# EAGLE schematic Internalcomputer (EAGLE 9.5.1)
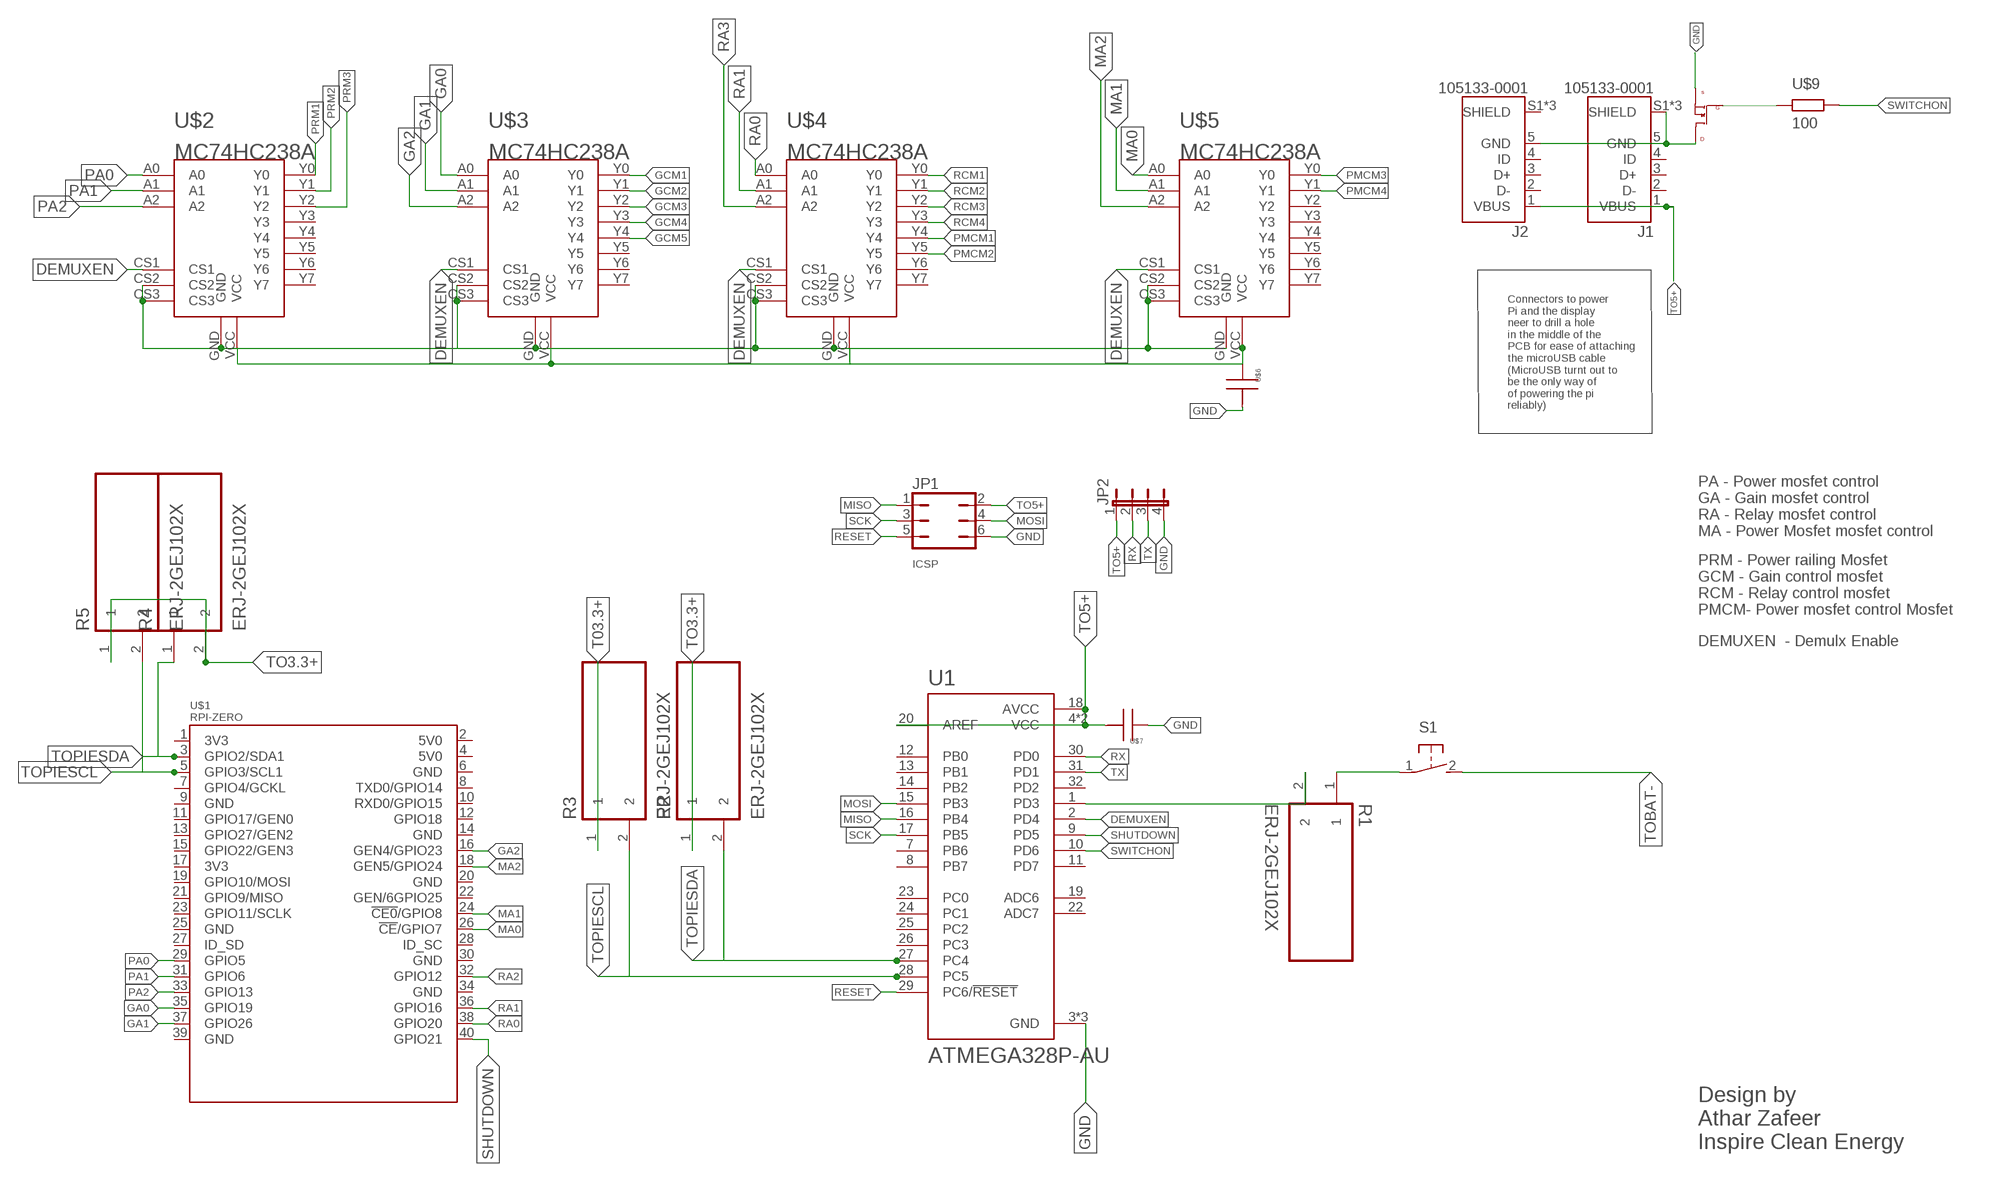
[diagram p0: schematic, sheet 1]

## Parts
J1  105133-0001  [MOLEX_105133-0001]
J2  105133-0001  [MOLEX_105133-0001]
JP1  JP3Q  [JP3Q]
JP2  JP4E  [JP4]
R1  ERJ-2GEJ102X  [RESC1005X40N]
R2  ERJ-2GEJ102X  [RESC1005X40N]
R3  ERJ-2GEJ102X  [RESC1005X40N]
R4  ERJ-2GEJ102X  [RESC1005X40N]
R5  ERJ-2GEJ102X  [RESC1005X40N]
S1  31-XX  [B3F-31XX]
U1  ATMEGA328P-AU  [QFP80P900X900X120-32N]
U$1  RPI-ZERO  [RASPBERRYPI_BASTELSTUBE_V13_RASPI_BOARD_B+_FULL]
U$2  MC74HC238A  [TSSOP−16]
U$3  MC74HC238A  [TSSOP−16]
U$4  MC74HC238A  [TSSOP−16]
U$5  MC74HC238A  [TSSOP−16]
U$6  CAPACTORFORTRANSFORMER  [C1210C156K8PACTU]
U$7  CAPACTORFORTRANSFORMER  [C1210C156K8PACTU]
U$8  SI2302A  [SOT-23]
U$9  RX0402_100  [RC0402_100]

## Nets
DEMUXEN: U1.2(PD4) U$2.CS1 U$3.CS1 U$4.CS1 U$5.CS1
GA0: U$1.35(GPIO19) U$3.A0
GA1: U$1.37(GPIO26) U$3.A1
GA2: U$1.16(GEN4/GPIO23) U$3.A2
GCM1: U$3.Y0
GCM2: U$3.Y1
GCM3: U$3.Y2
GCM4: U$3.Y3
GCM5: U$3.Y4
GND: J1.5(GND) J1.S1(SHIELD) J1.S2(SHIELD) J1.S3(SHIELD) J2.5(GND) JP1.6 JP2.4 U1.3(GND) U1.5(GND) U1.21(GND) U$6.P$2 U$7.P$1 U$8.D U$8.S
MA0: U$1.26(!CE!/GPIO7) U$5.A0
MA1: U$1.24(!CE0!/GPIO8) U$5.A1
MA2: U$1.18(GEN5/GPIO24) U$5.A2
MISO: JP1.1 U1.16(PB4)
MOSI: JP1.4 U1.15(PB3)
N$1: R1.1 S1.1(P)
N$2: R1.2 U1.1(PD3)
N$3: U$2.CS2 U$2.CS3 U$2.GND U$3.CS2 U$3.CS3 U$3.GND U$4.CS2 U$4.CS3 U$4.GND U$5.CS2 U$5.CS3 U$5.GND
N$5: U$8.G U$9.P$1
N$9: U$2.VCC U$3.VCC U$4.VCC U$5.VCC U$6.P$1
PA0: U$1.29(GPIO5) U$2.A0
PA1: U$1.31(GPIO6) U$2.A1
PA2: U$1.33(GPIO13) U$2.A2
PMCM1: U$4.Y4
PMCM2: U$4.Y5
PMCM3: U$5.Y0
PMCM4: U$5.Y1
PRM1: U$2.Y0
PRM2: U$2.Y1
PRM3: U$2.Y2
RA0: U$1.38(GPIO20) U$4.A0
RA1: U$1.36(GPIO16) U$4.A1
RA2: U$1.32(GPIO12)
RA3: U$4.A2
RCM1: U$4.Y0
RCM2: U$4.Y1
RCM3: U$4.Y2
RCM4: U$4.Y3
RESET: JP1.5 U1.29(PC6/!RESET)
RX: JP2.2 U1.30(PD0)
SCK: JP1.3 U1.17(PB5)
SHUTDOWN: U1.9(PD5) U$1.40(GPIO21)
SWITCHON: U1.10(PD6) U$9.P$2
T03.3+: R3.1
TO3.3+: R2.1 R4.2 R5.1
TO5+: J1.1(VBUS) J2.1(VBUS) JP1.2 JP2.1 U1.4(VCC) U1.6(VCC) U1.18(AVCC) U1.20(AREF) U$7.P$2
TOBAT-: S1.2(S)
TOPIESCL: R3.2 R5.2 U1.28(PC5) U$1.5(GPIO3/SCL1)
TOPIESDA: R2.2 R4.1 U1.27(PC4) U$1.3(GPIO2/SDA1)
TX: JP2.3 U1.31(PD1)
Unconnected: J1.2(D-) J1.3(D+) J1.4(ID) J2.2(D-) J2.3(D+) J2.4(ID) J2.S1(SHIELD) J2.S2(SHIELD) J2.S3(SHIELD) U1.7(PB6) U1.8(PB7) U1.11(PD7) U1.12(PB0) U1.13(PB1) U1.14(PB2) U1.19(ADC6) U1.22(ADC7) U1.23(PC0) U1.24(PC1) U1.25(PC2) U1.26(PC3) U1.32(PD2) U$1.1(3V3) U$1.2(5V0) U$1.4(5V0) U$1.6(GND) U$1.7(GPIO4/GCKL) U$1.8(TXD0/GPIO14) U$1.9(GND) U$1.10(RXD0/GPIO15) U$1.11(GPIO17/GEN0) U$1.12(GPIO18) U$1.13(GPIO27/GEN2) U$1.14(GND) U$1.15(GPIO22/GEN3) U$1.17(3V3) U$1.19(GPIO10/MOSI) U$1.20(GND) U$1.21(GPIO9/MISO) U$1.22(GEN/6GPIO25) U$1.23(GPIO11/SCLK) U$1.25(GND) U$1.27(ID_SD) U$1.28(ID_SC) U$1.30(GND) U$1.34(GND) U$1.39(GND) U$2.Y3 U$2.Y4 U$2.Y5 U$2.Y6 U$2.Y7 U$3.Y5 U$3.Y6 U$3.Y7 U$4.Y6 U$4.Y7 U$5.Y2 U$5.Y3 U$5.Y4 U$5.Y5 U$5.Y6 U$5.Y7

## Notes on the sheet
- Connectors to power
  Pi and the display
  neer to drill a hole 
  in the middle of the
  PCB for ease of attaching
  the microUSB cable
  (MicroUSB turnt out to
  be the only way of 
  of powering the pi
  reliably)
- PA - Power mosfet control  
  GA - Gain mosfet control
  RA - Relay mosfet control
  MA - Power Mosfet mosfet control
- ICSP
- PRM - Power railing Mosfet
  GCM - Gain control mosfet
  RCM - Relay control mosfet
  PMCM- Power mosfet control Mosfet
- DEMUXEN  - Demulx Enable
- Design by
  Athar Zafeer
  Inspire Clean Energy

## Library data of the parts
J1 J2 = 105133-0001:105133-0001: Conn Micro USB Type B RCP 5 POS 0.65mm Solder RA SMD 5 Terminal 1 Port Embossed T/R; DESCRIPTION: USB - micro B USB 2.0 Receptacle Connector 5 Position Surface Mount; DIGI-KEY_PART_NUMBER: WM9734CT-ND; DIGIKEY-PURCHASE-URL: https://snapeda.com/shop?store=DigiKey&id=423273; MF: Molex; MP: 1051330001; PACKAGE: None
JP1 = jumper:JP3Q: JUMPER
JP2 = jumper:JP4E: JUMPER
R1-R5 = Ampparts:ERJ-2GEJ102X; DESCRIPTION: 1 kOhms ±5% 0.1W, 1/10W Chip Resistor 0402 (1005 Metric) Automotive AEC-Q200 Thick Film; DIGI-KEY_PART_NUMBER: P1.0KJCT-ND; MF: Panasonic Electronic; MP: ERJ-2GEJ102X; PACKAGE: 1005 Panasonic Electronic Components
S1 = switch-omron:31-XX: OMRON SWITCH; MPN: B3F-3100; OC_FARNELL: 959704; OC_NEWARK: 36M3582
U1 = maincomputer parts:ATMEGA328P-AU: ATmega Series 20 MHz 32 KB Flash 2 KB SRAM 8-Bit Microcontroller - TQFP-32; DESCRIPTION: AVR AVR® ATmega Microcontroller IC 8-Bit 20MHz 32KB (16K x 16) FLASH 32-TQFP (7x7); DIGI-KEY_PART_NUMBER: ATMEGA328P-AURTR-ND; MF: Microchip Technology; MP: ATMEGA328P-AU; PACKAGE: TQFP-32 Microchip Technology
U$1 = maincomputer parts:RPI-ZERO
U$2-U$5 = maincomputer parts:MC74HC238A: MC74HC238A 1-of-8 Decoder/ Demultiplexer High−Performance Silicon−Gate CMOS The MC74HC238A is identical in pinout to the LS238. The device inputs are compatible with standard CMOS outputs; with pullup resistors, they are compatible with LSTTL outputs. The HC238A decodes a three−bit Address to one−of−eight active−high outputs. This device features three Chip Select inputs, two active−low and one active−high to facilitate the demultiplexing, cascading, and chip−selecting functions. The demultiplexing function is accomplished by using the Address inputs to select the desired device output; one of the Chip Selects is used as a data input while the other Chip Selects are held in their active states.
U$6 U$7 = CAP_Diode_Megger:CAPACTORFORTRANSFORMER: KEMET’s X5R dielectric features an 85°C maximum operating temperature and is considered “semi-stable.” The Electronics Components, Assemblies & Materials Association (EIA) characterizes X5R dielectric as a Class II material. Components of this classification are fixed, ceramic dielectric capacitors suited for bypass and decoupling applications or for frequency discriminating circuits where Q and stability of capacitance characteristics are not critical. X5R exhibits a predictable change in capacitance with respect to time and voltage and boasts a minimal change in capacitance with reference to ambient temperature. Capacitance change is limited to ±15% from −55°C to +85°C Modelled by Athar Zafeer
U$8 = Ampparts:SI2302A
U$9 = Ampparts:RX0402_100